# Altium schematic sheet [5] Temperature_readings.SchDoc
size A4
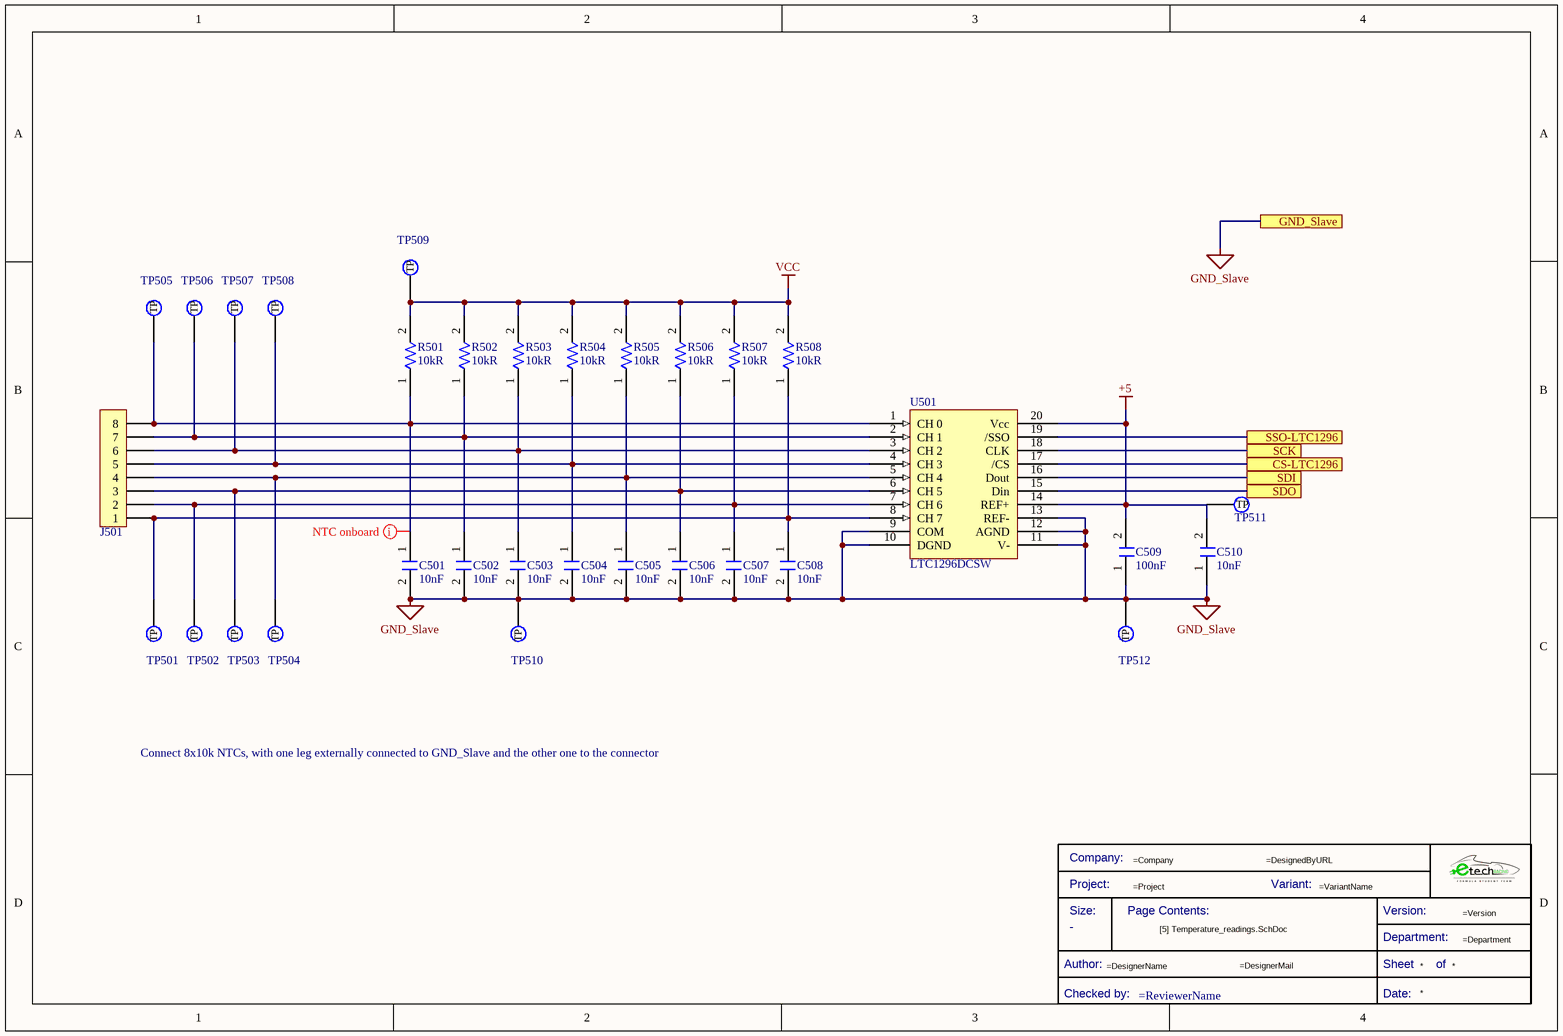
[diagram p0: [5] Temperature_readings.SchDoc]

## Parts
*  Title Block_template  (value not drawn)  (graphical)
C501  Capacitance: 10nF  [C0805FNPC-R]  (hidden comment: 885012207092)
C502  Capacitance: 10nF  [C0805FNPC-R]  (hidden comment: 885012207092)
C503  Capacitance: 10nF  [C0805FNPC-R]  (hidden comment: 885012207092)
C504  Capacitance: 10nF  [C0805FNPC-R]  (hidden comment: 885012207092)
C505  Capacitance: 10nF  [C0805FNPC-R]  (hidden comment: 885012207092)
C506  Capacitance: 10nF  [C0805FNPC-R]  (hidden comment: 885012207092)
C507  Capacitance: 10nF  [C0805FNPC-R]  (hidden comment: 885012207092)
C508  Capacitance: 10nF  [C0805FNPC-R]  (hidden comment: 885012207092)
C509  Capacitance: 100nF  [C0805FNPC-R]  (hidden comment: 885012207098)
C510  Capacitance: 10nF  [C0805FNPC-R]  (hidden comment: 885012207092)
J501  61301211121  [J_Pinheader_1x8]  (value not drawn)
R501  Resistance: 10kR  [R0805FTK]  (hidden comment: CR0805-JW-103ELF)
R502  Resistance: 10kR  [R0805FTK]  (hidden comment: CR0805-JW-103ELF)
R503  Resistance: 10kR  [R0805FTK]  (hidden comment: CR0805-JW-103ELF)
R504  Resistance: 10kR  [R0805FTK]  (hidden comment: CR0805-JW-103ELF)
R505  Resistance: 10kR  [R0805FTK]  (hidden comment: CR0805-JW-103ELF)
R506  Resistance: 10kR  [R0805FTK]  (hidden comment: CR0805-JW-103ELF)
R507  Resistance: 10kR  [R0805FTK]  (hidden comment: CR0805-JW-103ELF)
R508  Resistance: 10kR  [R0805FTK]  (hidden comment: CR0805-JW-103ELF)
TP501  TestPoint  [TestPoint]  (value not drawn)  (no BOM)
TP502  TestPoint  [TestPoint]  (value not drawn)  (no BOM)
TP503  TestPoint  [TestPoint]  (value not drawn)  (no BOM)
TP504  TestPoint  [TestPoint]  (value not drawn)  (no BOM)
TP505  TestPoint  [TestPoint]  (value not drawn)  (no BOM)
TP506  TestPoint  [TestPoint]  (value not drawn)  (no BOM)
TP507  TestPoint  [TestPoint]  (value not drawn)  (no BOM)
TP508  TestPoint  [TestPoint]  (value not drawn)  (no BOM)
TP509  TestPoint  [TestPoint]  (value not drawn)  (no BOM)
TP510  TestPoint  [TestPoint]  (value not drawn)  (no BOM)
TP511  TestPoint  [TestPoint]  (value not drawn)  (no BOM)
TP512  TestPoint  [TestPoint]  (value not drawn)  (no BOM)
U501  Manufacturer Part Number 1: LTC1296DCSW  [ADC_LTC1296]  (hidden comment: LTC1296)

## Ports
CS-LTC1296, GND_Slave, SCK, SDI, SDO, SSO-LTC1296

## Nets
+5: C509.2 C510.2 TP511.1(TP) U501.14(REF+) U501.20(Vcc)
GND_Slave: C501.2 C502.2 C503.2 C504.2 C505.2 C506.2 C507.2 C508.2 C509.1 C510.1 TP510.1(TP) TP512.1(TP) U501.9(COM) U501.10(DGND) U501.11(V-) U501.12(AGND) U501.13(REF-) ; port GND_Slave
VCC: R501.2 R502.2 R503.2 R504.2 R505.2 R506.2 R507.2 R508.2 TP509.1(TP)
CS-LTC1296: U501.17(/CS) ; port CS-LTC1296
SCK: U501.18(CLK) ; port SCK
SDI: U501.16(Dout) ; port SDI
SDO: U501.15(Din) ; port SDO
SSO-LTC1296: U501.19(/SSO) ; port SSO-LTC1296
NetC501_1: C501.1 J501.8 R501.1 TP505.1(TP) U501.1(CH_0)
NetC502_1: C502.1 J501.7 R502.1 TP506.1(TP) U501.2(CH_1)
NetC503_1: C503.1 J501.6 R503.1 TP507.1(TP) U501.3(CH_2)
NetC504_1: C504.1 J501.5 R504.1 TP508.1(TP) U501.4(CH_3)
NetC505_1: C505.1 J501.4 R505.1 TP504.1(TP) U501.5(CH_4)
NetC506_1: C506.1 J501.3 R506.1 TP503.1(TP) U501.6(CH_5)
NetC507_1: C507.1 J501.2 R507.1 TP502.1(TP) U501.7(CH_6)
NetC508_1: C508.1 J501.1 R508.1 TP501.1(TP) U501.8(CH_7)

## Layout directives
mark named NTC onboard: NetC501_1

## Notes on the sheet
- Connect 8x10k NTCs, with one leg externally connected to GND_Slave and the other one to the connector
- Title
- Size:
- Date:
- A4
- Number:
- Time:
- Revision:
- Sheet
- of
- File:
- (in symbol Title Block_template) Company:; Project:; Variant:; Size:; Page Contents:; Version:; Department:; Author:; Sheet; of; Checked by:; Date:

## Library data of the parts
* = Title Block_template: Standard Title Block; Category: Title Block; Checked by:: =ReviewerName; Size: -
C501-C508 C510 = C10n-50V-0805FNPC-X7R: Cap, 0.01ΜF, 50V, 10%, X7R, 0805; Manufacturer 1: Wurth Electronics; .Creator: DR; Supplier 1: RSComponents; Manufacturer Part Number 1: 885012207092; RoHS: Yes; Category: Ceramic Capacitors; Stock 1: 1; Pricing 1: 4000=0,03200, 12000=0,03100 (USD); Mount: Surface Mount; Case/Package: 0805; Case Code (Metric): 2012; Case Code (Imperial): 0805; Min Operating Temperature: -55°C; Max Operating Temperature: 125°C; Packaging: Cut Tape; Voltage Rating: 50V; Dielectric: X7R; Tolerance: 10%; Voltage Rating (DC): 50V; Length: 0.079inch; Width: 0.049inch; Thickness: 0.035inch; REACH SVHC: Unknown; RoHS Compliant: Yes; ComponentLink1URL: http://www.farnell.com/datasheets/1958497.pdf?src-supplier=Farnell; ComponentLink1Description: http://www.farnell.com/datasheets/1958497.pdf?src-supplier=Farnell; ComponentLink2URL: http://www.farnell.com/datasheets/1958497.pdf?src-supplier=Element14; ComponentLink2Description: http://www.farnell.com/datasheets/1958497.pdf?src-supplier=Element14; ComponentLink3URL: http://www.farnell.com/datasheets/1958497.pdf?src-supplier=Newark; ComponentLink3Description: http://www.farnell.com/datasheets/1958497.pdf?src-supplier=Newark; ComponentLink4URL: https://katalog.we-online.de/pbs/datasheet/885012207092.pdf?src-supplier=Digi-Key; ComponentLink4Description: https://katalog.we-online.de/pbs/datasheet/885012207092.pdf?src-supplier=Digi-Key; Supplier Part Number 1: 1813941
C509 = C100n-50V-0805FNPC-X7R: Cap, 0.1ΜF, 50V, 10%, X7R, 0805; Manufacturer 1: Wurth Electronics; .Creator: DR; Supplier 1: RSComponents; Manufacturer Part Number 1: 885012207098; RoHS: Yes; Category: Ceramic Capacitors; Stock 1: 8000; Pricing 1: 100=0,10200, 500=0,07100, 2000=0,06100 (GBP); Mount: Surface Mount; Case/Package: 0805; Case Code (Metric): 2012; Case Code (Imperial): 0805; Min Operating Temperature: -55°C; Max Operating Temperature: 125°C; Packaging: Cut Tape; Voltage Rating: 50V; Dielectric: X7R; Tolerance: 10%; Voltage Rating (DC): 50V; Length: 0.079inch; Width: 0.049inch; Thickness: 0.035inch; REACH SVHC: Unknown; RoHS Compliant: Yes; ComponentLink1URL: http://www.farnell.com/datasheets/1958498.pdf?src-supplier=Farnell; ComponentLink1Description: http://www.farnell.com/datasheets/1958498.pdf?src-supplier=Farnell; ComponentLink2URL: http://www.farnell.com/datasheets/1958498.pdf?src-supplier=Element14; ComponentLink2Description: http://www.farnell.com/datasheets/1958498.pdf?src-supplier=Element14; ComponentLink3URL: https://katalog.we-online.de/pbs/datasheet/885012207098.pdf?src-supplier=Digi-Key; ComponentLink3Description: https://katalog.we-online.de/pbs/datasheet/885012207098.pdf?src-supplier=Digi-Key; ComponentLink4URL: http://www.farnell.com/datasheets/1958498.pdf?src-supplier=Newark; ComponentLink4Description: http://www.farnell.com/datasheets/1958498.pdf?src-supplier=Newark; Supplier Part Number 1: 1813493
J501 = J_Pinheader_1x8: THT Vertical Pin Header WR-PHD, Pitch 2.54 mm, Single Row, 12 pins; Manufacturer 1: Wurth Electronics; Number of Positions: 12; Gender: Male; Connector Type: Male Pin; Pitch: 0.1inch; Supplier 1: Digi-Key; Manufacturer Part Number 1: 61301211121; RoHS: Yes; Category: Connectors; Stock 1: 2124; Pricing 1: 1=0,57000, 10=0,48400, 25=0,40400, 50=0,33700, 100=0,30600, 1000=0,27800 (USD); Mount: Through Hole; Contact Plating: Gold; Contact Material: Copper; Color: Black; Number of Rows: 1; Packaging: Bulk; Termination: Solder; Number of Contacts: 12; Contact Mating Length: 0.236inch; REACH SVHC: Unknown; RoHS Compliant: Yes; ComponentLink1URL: http://www.farnell.com/cad/1737268.pdf?src-supplier=Element14; ComponentLink1Description: http://www.farnell.com/cad/1737268.pdf?src-supplier=Element14; ComponentLink2URL: https://katalog.we-online.de/em/datasheet/6130xx11121.pdf?src-supplier=Digi-Key; ComponentLink2Description: https://katalog.we-online.de/em/datasheet/6130xx11121.pdf?src-supplier=Digi-Key
R501-R508 = R10k-0805FTK: BOURNS         CR0805-JW-103ELF            Surface Mount Chip Resistor, Thick Film, CR Series, 10 kohm, 125 mW,  5%, 150 V; Temperature Coefficient: 200ppm/°C; Power Rating: 125mW; Voltage Rating: 150V; Voltage Rating (DC): 100V; .Creator: DR; Supplier 1: Arrow Electronics; Manufacturer 1: Bourns; Manufacturer Part Number 1: CR0805-JW-103ELF; RoHS: Yes; Category: Chip SMD Resistors; Stock 1: 57566; Pricing 1: 1=0,05790, 10=0,01540, 25=0,01340, 100=0,00340 (USD); Mount: Surface Mount; Case/Package: 0805; Number of Pins: 2; Contact Plating: Tin; Case Code (Metric): 2012; Case Code (Imperial): 0805; Min Operating Temperature: -55°C; Max Operating Temperature: 155°C; Tolerance: 5%; Resistor Type: Thick Film; Package Quantity: 1; Packaging: Tape and Reel; Number of Terminations: 2; Termination: SMD/SMT; Max Power Dissipation: 125mW; Features: Moisture Resistant; Series: CR0805; Construction: Rectangular; Resistance Tolerance: 5%; Technology: THICK FILM; Length: 2mm; Width: 1.25mm; Height: 0.5mm; Depth: 1.25mm; Thickness: 508um; Radiation Hardening: No; REACH SVHC: No SVHC; Military Standard: Not; RoHS Compliant: Yes; ComponentLink1URL: https://datasheet.ciiva.com/11821/0900766b80fcdb72-11821135.pdf?src-supplier=RSComponents; ComponentLink1Description: https://datasheet.ciiva.com/11821/0900766b80fcdb72-11821135.pdf?src-supplier=RSComponents; ComponentLink2URL: https://datasheet.ciiva.com/9122/chpreztr-9122374.pdf?src-supplier=Avnet; ComponentLink2Description: https://datasheet.ciiva.com/9122/chpreztr-9122374.pdf?src-supplier=Avnet; ComponentLink3URL: https://datasheet.ciiva.com/22693/1902866-22693254.pdf?src-supplier=Element14; ComponentLink3Description: https://datasheet.ciiva.com/22693/1902866-22693254.pdf?src-supplier=Element14; ComponentLink4URL: https://datasheet.ciiva.com/7986/691949-7986187.pdf?src-supplier=Element14; ComponentLink4Description: https://datasheet.ciiva.com/7986/691949-7986187.pdf?src-supplier=Element14; ComponentLink5URL: https://datasheet.ciiva.com/30065/159chpreztr-30065976.pdf?src-supplier=Onlinecomponents.com; ComponentLink5Description: https://datasheet.ciiva.com/30065/159chpreztr-30065976.pdf?src-supplier=Onlinecomponents.com; ComponentLink6URL: https://datasheet.ciiva.com/16783/70154685-16783482.pdf?src-supplier=Allied+Electronics; ComponentLink6Description: https://datasheet.ciiva.com/16783/70154685-16783482.pdf?src-supplier=Allied+Electronics; ComponentLink7URL: https://datasheet.ciiva.com/5548/chpreztr-5548491.pdf?src-supplier=Mouser; ComponentLink7Description: https://datasheet.ciiva.com/5548/chpreztr-5548491.pdf?src-supplier=Mouser; ComponentLink8URL: https://datasheet.ciiva.com/6559/chpreztr-6559900.pdf?src-supplier=Digi-Key; ComponentLink8Description: https://datasheet.ciiva.com/6559/chpreztr-6559900.pdf?src-supplier=Digi-Key; ComponentLink9URL: https://datasheet.ciiva.com/6559/chpreztr-6559901.pdf?src-supplier=Digi-Key; ComponentLink9Description: https://datasheet.ciiva.com/6559/chpreztr-6559901.pdf?src-supplier=Digi-Key; ComponentLink10URL: https://datasheet.ciiva.com/7985/1856384-7985869.pdf?src-supplier=Element14; ComponentLink10Description: https://datasheet.ciiva.com/7985/1856384-7985869.pdf?src-supplier=Element14; ComponentLink11URL: https://datasheet.ciiva.com/48692/001055517-da-01-en-smd-wid-cr0805-jw-103elf-10k-ohm-1-8w-48692118.pdf?src-supplier=Conrad; ComponentLink11Description: https://datasheet.ciiva.com/48692/001055517-da-01-en-smd-wid-cr0805-jw-103elf-10k-ohm-1-8w-48692118.pdf?src-supplier=Conrad; Supplier Part Number 1: CR0805-JW-103ELF
TP501-TP512 = TestPoint: Test Point 1x1 mm; .Creator: GP; Category: TestPoint; .PCBcheck: GP; .SCHcheck: GP
U501 = ADC-LTC1296: 8-Channel Single ADC SAR 46.5ksps 12-bit Serial 20-Pin SOIC W; Manufacturer 1: Analog Devices / Linear Technology; Interface: Serial,Parallel; Sampling Rate: 46500S/s; Resolution: 12b; Supply Type: Dual; Number of Bits: 12; Max Supply Voltage: 12V; Dual Supply Voltage: 5V; Number of Elements: 1; Polarity: Bipolar,Unipolar; Power Dissipation: 500mW; Integral Nonlinearity (INL): 0.75LSB; .Creator: DR; ComponentLink1Description: Datasheet; ComponentLink2Description: Where buy it; Supplier 1: Newark; RoHS: No; Category: Analog to Digital Converters (ADCs); Mount: Surface Mount; Case/Package: SOIC; Number of Pins: 20; Min Operating Temperature: 0°C; Max Operating Temperature: 70°C; Package Quantity: 38; Packaging: Rail/Tube; Operating Supply Voltage: 5V; Lead Free: Contains Lead; RoHS Compliant: No; ComponentLink3URL: https://datasheet.ciiva.com/1250/3526-1250235.pdf?src-supplier=Digi-Key; ComponentLink3Description: https://datasheet.ciiva.com/1250/3526-1250235.pdf?src-supplier=Digi-Key; Supplier Part Number 1: 56M0212